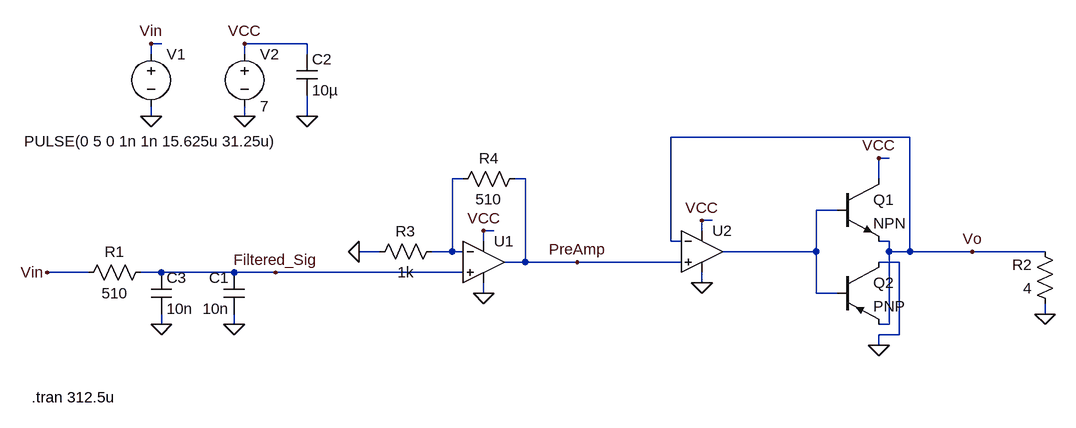
[diagram p0: schematic The Sound System.asc]
The Sound System.asc, the LTspice schematic file:
Version 4
SHEET 1 1444 680
WIRE -304 -224 -320 -224
WIRE -80 -224 -176 -224
WIRE -320 -208 -320 -224
WIRE -176 -208 -176 -224
WIRE -80 -208 -80 -224
WIRE -320 -112 -320 -128
WIRE -176 -112 -176 -128
WIRE -80 -112 -80 -144
WIRE 848 -80 480 -80
WIRE 816 -48 800 -48
WIRE 160 -16 144 -16
WIRE 256 -16 240 -16
WIRE 800 -16 800 -48
WIRE 736 32 704 32
WIRE 544 48 528 48
WIRE 208 64 192 64
WIRE 528 64 528 48
WIRE 192 80 192 64
WIRE 480 80 480 -80
WIRE 496 80 480 80
WIRE 816 80 800 80
WIRE 32 96 0 96
WIRE 144 96 144 -16
WIRE 144 96 112 96
WIRE 160 96 144 96
WIRE 704 96 704 32
WIRE 704 96 560 96
WIRE 816 96 816 80
WIRE 848 96 848 -80
WIRE 848 96 816 96
WIRE 944 96 848 96
WIRE 1056 96 944 96
WIRE 256 112 256 -16
WIRE 256 112 224 112
WIRE 336 112 256 112
WIRE 496 112 336 112
WIRE 832 112 800 112
WIRE -416 128 -480 128
WIRE -304 128 -336 128
WIRE -192 128 -304 128
WIRE -128 128 -192 128
WIRE 160 128 -128 128
WIRE 528 144 528 128
WIRE 192 160 192 144
WIRE 704 160 704 96
WIRE 736 160 704 160
WIRE 1056 192 1056 176
WIRE -304 208 -304 192
WIRE -192 208 -192 192
WIRE 816 208 816 96
WIRE 816 208 800 208
WIRE 832 224 832 112
WIRE 832 224 800 224
WIRE 800 240 800 224
FLAG -320 -112 0
FLAG -176 -112 0
FLAG 528 144 0
FLAG 1056 192 0
FLAG 800 240 0
FLAG -192 208 0
FLAG -320 -224 Vin
FLAG -480 128 Vin
FLAG -176 -224 VCC
FLAG 528 48 VCC
FLAG 800 -48 VCC
FLAG 192 160 0
FLAG 192 64 VCC
FLAG -128 128 Filtered_Sig
FLAG 336 112 PreAmp
FLAG 944 96 Vo
FLAG -304 208 0
FLAG 0 96 0
FLAG -80 -112 0
SYMBOL voltage -320 -224 R0
WINDOW 3 -195 150 Left 2
WINDOW 123 0 0 Left 0
WINDOW 39 0 0 Left 0
SYMATTR Value PULSE(0 5 0 1n 1n 15.625u 31.25u)
SYMATTR InstName V1
SYMBOL voltage -176 -224 R0
WINDOW 123 0 0 Left 0
WINDOW 39 0 0 Left 0
SYMATTR InstName V2
SYMATTR Value 7
SYMBOL npn 736 -16 R0
SYMATTR InstName Q1
SYMBOL pnp 736 112 R0
SYMATTR InstName Q2
SYMBOL res -320 112 R90
WINDOW 0 0 56 VBottom 2
WINDOW 3 32 56 VTop 2
SYMATTR InstName R1
SYMATTR Value 510
SYMBOL res 1072 192 R180
WINDOW 0 36 76 Left 2
WINDOW 3 36 40 Left 2
SYMATTR InstName R2
SYMATTR Value 4
SYMBOL cap -176 192 R180
WINDOW 0 24 56 Left 2
WINDOW 3 24 8 Left 2
SYMATTR InstName C1
SYMATTR Value 10n
SYMBOL OpAmps\\UniversalOpAmp 528 96 R0
SYMATTR InstName U2
SYMBOL OpAmps\\UniversalOpAmp 192 112 R0
SYMATTR InstName U1
SYMBOL res 128 80 R90
WINDOW 0 0 56 VBottom 2
WINDOW 3 32 56 VTop 2
SYMATTR InstName R3
SYMATTR Value 1k
SYMBOL res 256 -32 R90
WINDOW 0 0 56 VBottom 2
WINDOW 3 32 56 VTop 2
SYMATTR InstName R4
SYMATTR Value 510
SYMBOL cap -320 128 R0
SYMATTR InstName C3
SYMATTR Value 10n
SYMBOL cap -96 -208 R0
SYMATTR InstName C2
SYMATTR Value 10µ
TEXT -504 320 Left 2 !.tran 312.5u

The netlist it stands for:
* The Sound System.asc
V1 Vin 0 PULSE(0 5 0 1n 1n 15.625u 31.25u)
V2 VCC 0 7
Q1 VCC N002 Vo 0 NPN
Q2 0 N002 Vo 0 PNP
R1 Filtered_Sig Vin 510
R2 0 Vo 4
C1 0 Filtered_Sig 10n
XU2 PreAmp Vo VCC 0 N002 level1 Avol=1Meg GBW=10Meg Vos=0 En=0 Enk=0 In=0 Ink=0 Rin=500Meg  ; pins In+ In- V+ V- OUT
XU1 Filtered_Sig N001 VCC 0 PreAmp level1 Avol=1Meg GBW=10Meg Vos=0 En=0 Enk=0 In=0 Ink=0 Rin=500Meg  ; pins In+ In- V+ V- OUT
R3 N001 0 1k
R4 PreAmp N001 510
C3 Filtered_Sig 0 10n
C2 VCC 0 10µ
.model NPN NPN
.model PNP PNP
.lib standard.bjt
.tran 312.5u
.lib UniversalOpAmp1.lib
.backanno
.end